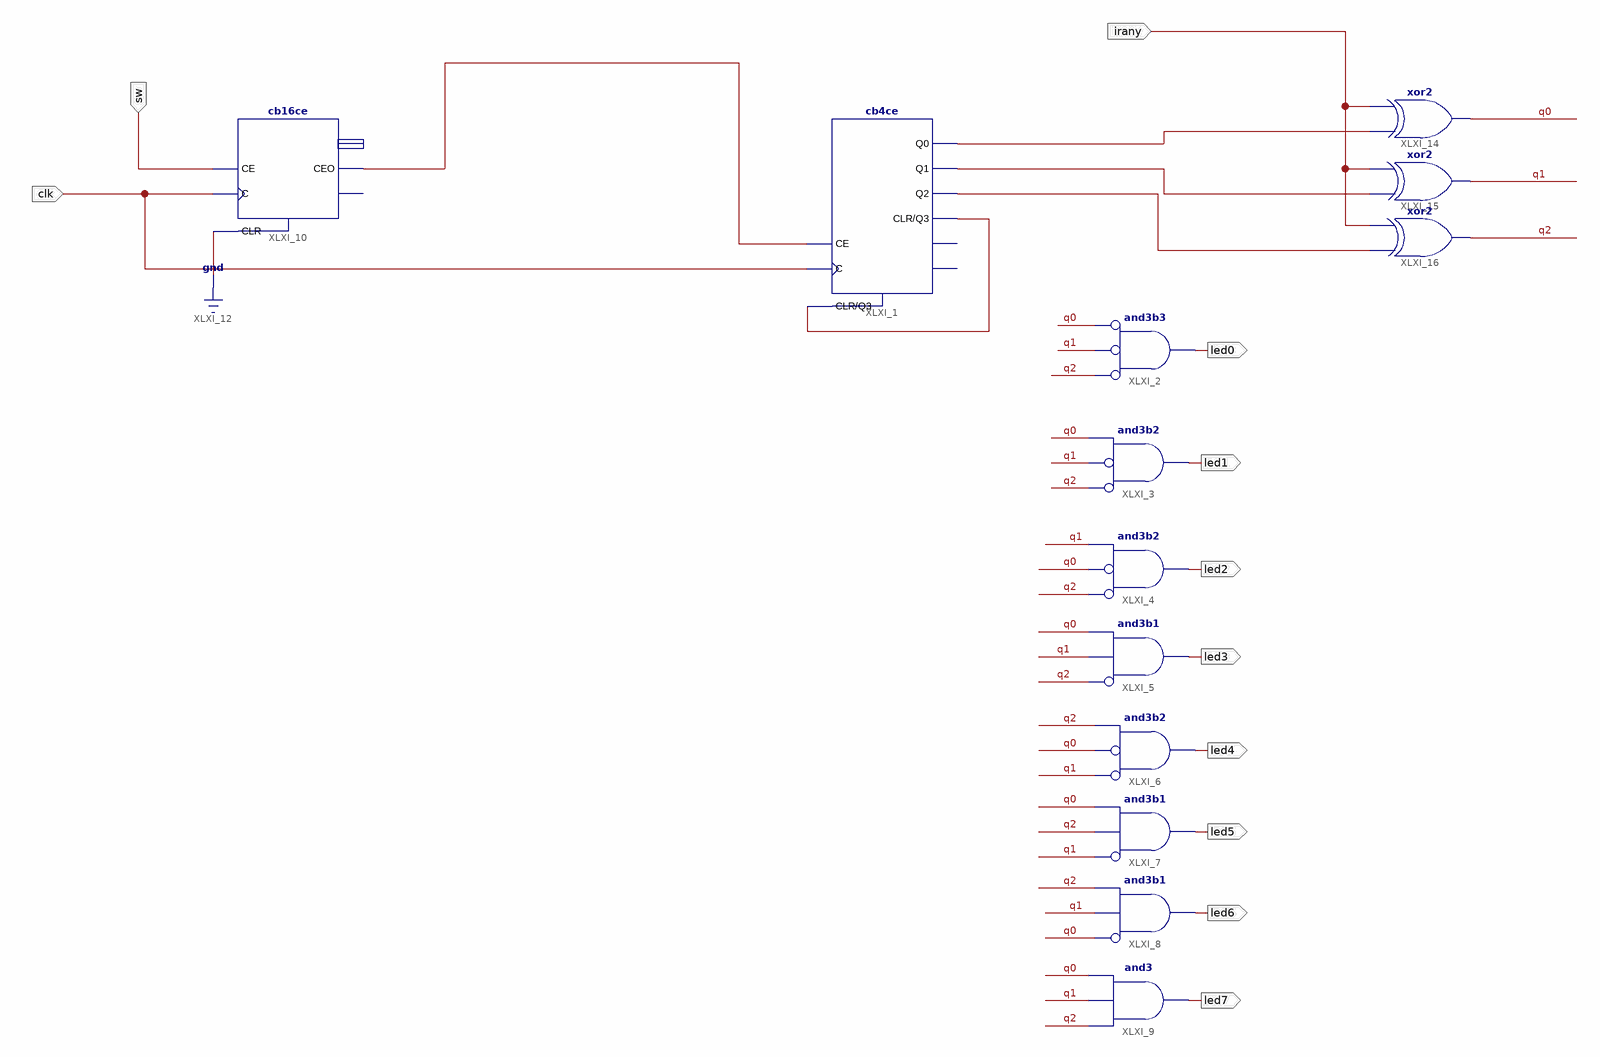
[diagram p0: schematic sheet 1]
// Xilinx ISE schematic knight_rider_actual.sch (spartan3e) as structural Verilog: 13 symbols, 11 ports
module knight_rider_actual (
  input  sw,
  input  clk,
  input  irany,
  output led0,
  output led1,
  output led2,
  output led3,
  output led4,
  output led5,
  output led6,
  output led7
);

  wire q0, q1, q2, XLXN_6, XLXN_43, XLXN_56, XLXN_57, XLXN_58;

  cb4ce XLXI_1 (
    .C(clk), .CE(XLXN_43), .CLR(XLXN_6), .Q0(XLXN_56), .Q1(XLXN_57), .Q2(XLXN_58), .Q3(XLXN_6));  // open: CEO, TC
  and XLXI_2 (led0, ~q2, ~q1, ~q0);  // and3b3
  and XLXI_3 (led1, ~q2, ~q1, q0);  // and3b2
  and XLXI_4 (led2, ~q2, ~q0, q1);  // and3b2
  and XLXI_5 (led3, ~q2, q1, q0);  // and3b1
  and XLXI_6 (led4, ~q1, ~q0, q2);  // and3b2
  and XLXI_7 (led5, ~q1, q2, q0);  // and3b1
  and XLXI_8 (led6, ~q0, q1, q2);  // and3b1
  and XLXI_9 (led7, q2, q1, q0);
  cb16ce XLXI_10 (.C(clk), .CE(sw), .CLR(1'b0), .CEO(XLXN_43));  // open: Q, TC
  xor XLXI_14 (q0, XLXN_56, irany);
  xor XLXI_15 (q1, XLXN_57, irany);
  xor XLXI_16 (q2, XLXN_58, irany);
endmodule
